# Altium schematic sheet Connectors.SchDoc: RP2040 Pico and HC-06 connections
size A4; Organization: Ernst-Abbe-Hochschule Jena; Address1: FB Maschinenbau; Address2: Carl-Zeiss-Promenade 2; Address3: 07745 Jena; Address4: Germany; DocumentNumber: 3; SheetNumber: 3; SheetTotal: 3
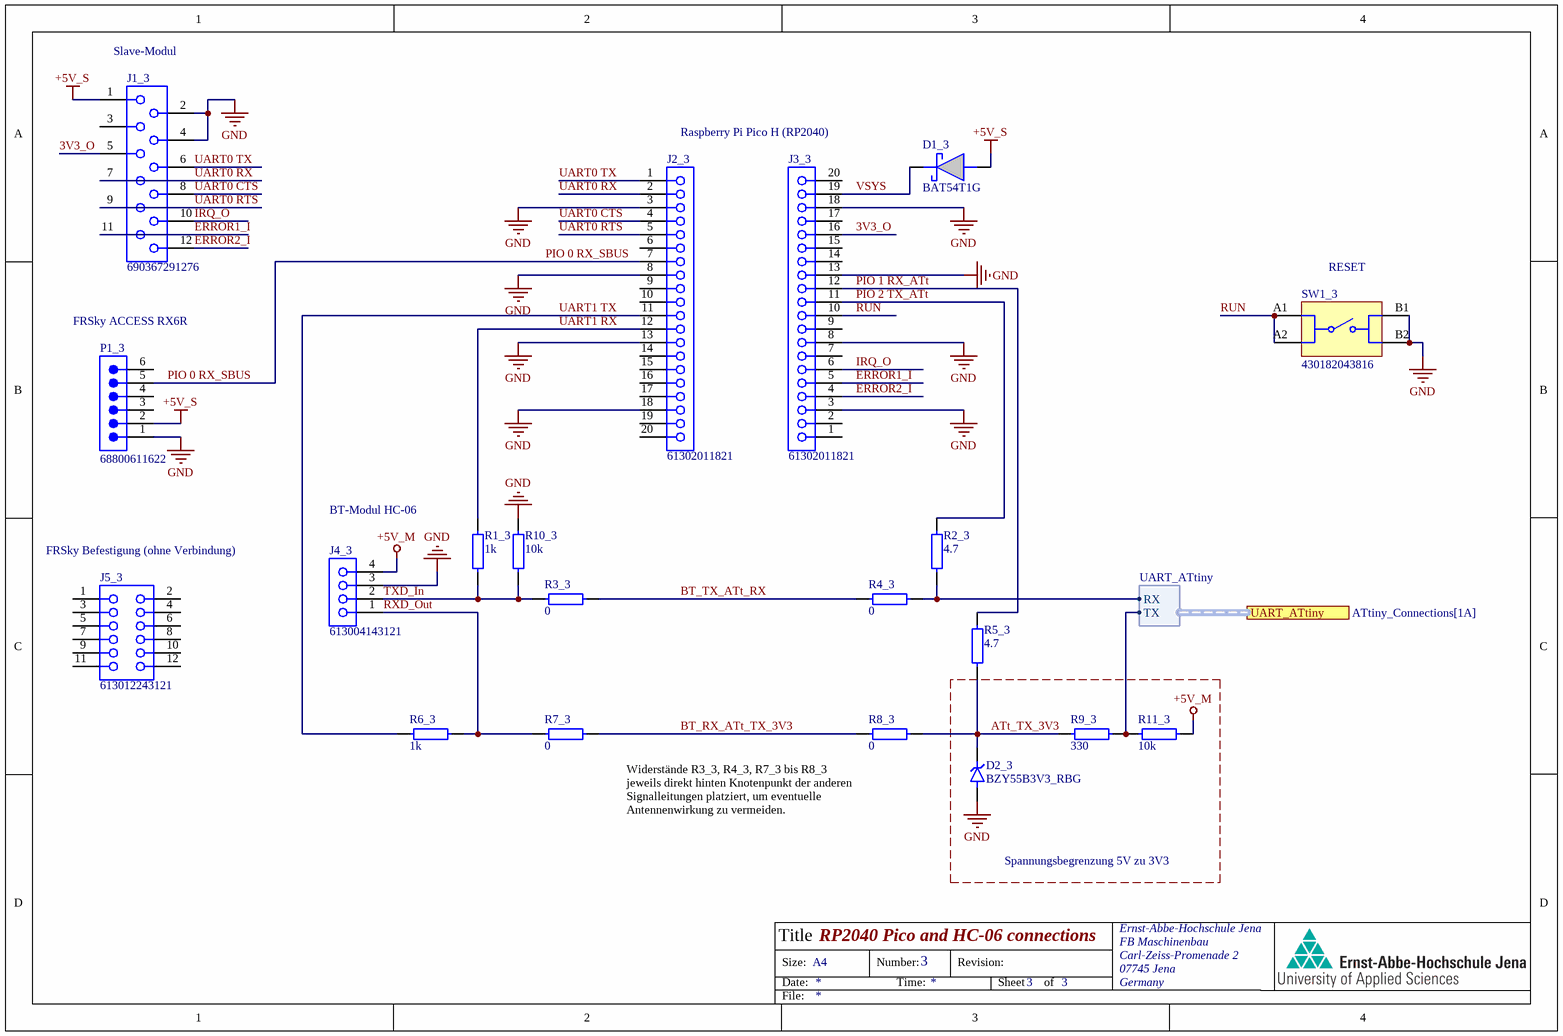
[diagram p0: Connectors.SchDoc]

## Parts
D1_3  BAT54T1G  [SOD3716X135N]
D2_3  BZY55B3V3_RBG  [DIO_BZY55B3V3_RBG]
J1_3  690367291276  [690367291276]
J2_3  61302011821  [61302011821]
J3_3  61302011821  [61302011821]
J4_3  613004143121  [613004143121]
J5_3  613012243121  [613012243121]
P1_3  68800611622  [68800611622]
R1_3  1k  [R-SMD-0805]
R2_3  4.7  [R-SMD-0805]
R3_3  0  [R-SMD-0805]
R4_3  0  [R-SMD-0805]
R5_3  4.7  [R-SMD-0805]
R6_3  1k  [R-SMD-0805]
R7_3  0  [R-SMD-0805]
R8_3  0  [R-SMD-0805]
R9_3  330  [R-SMD-0805]
R10_3  10k  [R-SMD-0805]
R11_3  10k  [R-SMD-0805]
SW1_3  430182043816  [430182043816]

## Blocks framed on the sheet
Spannungsbegrenzung 5V zu 3V3: D2_3 R9_3 R11_3

## Ports
UART_ATtiny (harness UART_ATtiny, see ATtiny_Connections[1A])

## Harnesses
UART_ATtiny: RX, TX

## Nets
+5V_M: J4_3.4 R11_3.1
+5V_S: D1_3.2(A) J1_3.1 P1_3.2
GND: D2_3.A J1_3.2 J1_3.4 J2_3.3 J2_3.8 J2_3.13 J2_3.18 J3_3.3 J3_3.8 J3_3.13 J3_3.18 J4_3.3 P1_3.1 R10_3.2 SW1_3.B1 SW1_3.B2
3V3_O: J1_3.5 J3_3.16
ATt_TX_3V3: D2_3.C(K) R5_3.1 R8_3.2 R9_3.2
BT_RX_ATt_TX_3V3: R7_3.2 R8_3.1
BT_TX_ATt_RX: R3_3.2 R4_3.1
ERROR1_I: J1_3.11 J3_3.5
ERROR2_I: J1_3.12 J3_3.4
IRQ_O: J1_3.10 J3_3.6
PIO 0 RX_SBUS: J2_3.7 P1_3.5
PIO 1 RX_ATt: J3_3.12 R5_3.2
PIO 2 TX_ATt: J3_3.11 R2_3.2
RUN: J3_3.10 SW1_3.A1 SW1_3.A2
RXD_Out: J4_3.1 R6_3.2 R7_3.1
TXD_In: J4_3.2 R1_3.1 R3_3.1 R10_3.1
UART0 CTS: J1_3.8 J2_3.4
UART0 RTS: J1_3.9 J2_3.5
UART0 RX: J1_3.7 J2_3.2
UART0 TX: J1_3.6 J2_3.1
UART1 RX: J2_3.12 R1_3.2
UART1 TX: J2_3.11 R6_3.1
VSYS: D1_3.1(K) J3_3.19
NetR2_3_1: R2_3.1 R4_3.2 ; port UART_ATtiny.RX
NetR9_3_1: R9_3.1 R11_3.2 ; port UART_ATtiny.TX

Not connected (* = marked no-connect by the designer): J1_3 3; J2_3 6 9 10 14 15 16 17 19 20; J3_3 1 2 7 9 14 15 17 20; J5_3 1 2 3 4 5 6 7 8 9 10 11 12; P1_3 3 4 6

## Notes on the sheet
- (near J1_3) Slave-Modul
- Raspberry Pi Pico H (RP2040)
- (near SW1_3) RESET
- (near P1_3) FRSky ACCESS RX6R
- BT-Modul HC-06
- (near J5_3) FRSky Befestigung (ohne Verbindung)
- Widerstände R3_3, R4_3, R7_3 bis R8_3 jeweils direkt hinten Knotenpunkt der anderen Signalleitungen platziert, um eventuelle Antennenwirkung zu vermeiden.
- Title
- Size:
- Date:
- A4
- Number:
- Time:
- Revision:
- Sheet
- of
- File:

## Library data of the parts
D1_3 = BAT54T1G: S Prefix for Automotive and Other Applications Requiring Unique Site and Control Change Requirements; AEC-Q101 Qualified and PPAP Capable; Low Forward Voltage 350 mV (Typ) @ IF = 10 mA; Extremely Fast Switching Speed; These Devices are Pb-Free, Halogen Free/BFR Free and are RoHS Compliant; Manufacturer_Name: onsemi; Geometry.Height: 1.35mm; Manufacturer_Part_Number: BAT54T1G; Mouser Part Number: 863-BAT54T1G; Mouser Price/Stock: https://www.mouser.co.uk/ProductDetail/onsemi/BAT54T1G?qs=vLkC5FC1VN9XK%252B%252BtdP3lYw%3D%3D; Arrow Part Number: BAT54T1G; Arrow Price/Stock: https://www.arrow.com/en/products/bat54t1g/on-semiconductor?utm_currency=USD&region=nac; Datasheet Link: https://www.onsemi.com/pub/Collateral/BAT54T1-D.PDF
J1_3 = 690367291276: WR-MM Mini Module Connector, Female, SMT, with Latch & Polarization, Straight, pitch 2.54mm, 12p; Manufacturer: Wurth Elektronik; Contact Resistance: 10mΩ; Insulation Resistance: 1000MΩ; Rated Current: 1.5A; Working Voltage: 250VAC; Withstanding Voltage: 500VAC; ComponentLink1Description: Website Link; ComponentLink1URL: https://www.we-online.com/redexpert/article/690367291276?ad; ComponentLink2Description: Datasheet Link; ComponentLink2URL: https://www.we-online.com/redexpert/spec/690367291276?ad; Manufacturer Part Number: 690367291276; Category: Board-to-Board Connectors; Match Code: WR-MM; Mount: Surface Mount; Operating Temperature Max: 105°C; Operating Temperature Min: -40°C; Packaging: Tape and Reel; Length: 19.84mm; Gender: Female; Number of Pins: 12; Orientation: Straight; Pitch: 2.54mm
J2_3 J3_3 = 61302011821: WR-PHD Socket Header, THT, Vertical, pitch 2.54mm, 1 Row, 20P; Manufacturer: Wurth Elektronik; Contact Resistance: 20mOhm; Rated Current: 3A; Working Voltage: 250V; Withstanding Voltage: 500V; Manufacturer Part Number: 61302011821; Category: Board-to-Board Connectors; Match Code: WR-PHD; ComponentLink1Description: Website Link; ComponentLink1URL: https://www.we-online.com/redexpert/article/61302011821?ad; ComponentLink2Description: Datasheet Link; ComponentLink2URL: https://www.we-online.com/redexpert/spec/61302011821?ad; Mount: Through Hole; Operating Temperature Max: 105°C; Operating Temperature Min: -40°C; Packaging: Tray; Gender: Socket Header; Number of Pins: 20; Number of Rows: 1; Orientation: Vertical; Pitch: 2.54mm
  J3_3: ClassName: RPI_Pico
J4_3 = 613004143121: WR-PHD Socket Header, THT, Angled, pitch 2.54mm, 1 Row, 4P; Manufacturer: Wurth Elektronik; Contact Resistance: 20mOhm; Rated Current: 3A; Working Voltage: 250V; Withstanding Voltage: 500V; Manufacturer Part Number: 613004143121; Category: Board-to-Board Connectors; Match Code: WR-PHD; ComponentLink1Description: Website Link; ComponentLink1URL: https://www.we-online.com/redexpert/article/613004143121?ad; ComponentLink2Description: Datasheet Link; ComponentLink2URL: https://www.we-online.com/redexpert/spec/613004143121?ad; Mount: Through Hole; Operating Temperature Max: 125°C; Operating Temperature Min: -40°C; Packaging: Tray; Gender: Socket Header; Number of Pins: 4; Number of Rows: 1; Orientation: Angled; Pitch: 2.54mm
J5_3 = 613012243121: WR-PHD Socket Header, THT, Angled, pitch 2.54mm, 2 Row, 12P; Manufacturer: Wurth Elektronik; Contact Resistance: 20mOhm; Rated Current: 3A; Working Voltage: 250V; Withstanding Voltage: 500V; Manufacturer Part Number: 613012243121; Category: Board-to-Board Connectors; Match Code: WR-PHD; ComponentLink1Description: Website Link; ComponentLink1URL: https://www.we-online.com/redexpert/article/613012243121?ad; ComponentLink2Description: Datasheet Link; ComponentLink2URL: https://www.we-online.com/redexpert/spec/613012243121?ad; Mount: Through Hole; Operating Temperature Max: 125°C; Operating Temperature Min: -40°C; Packaging: Tray; Gender: Socket Header; Number of Pins: 12; Number of Rows: 2; Orientation: Angled; Pitch: 2.54mm
P1_3 = 68800611622: WR-WTB “J” Type THT Vertical Male Shrouded Header, pitch 2.5 mm, 6 pins; Manufacturer: Wurth Elektronik; Pitch: 2.5 mm; Rated Current: 3 A; Working Voltage: 250 V(AC); Contact Resistance: 20 mΩ; Withstanding Voltage: 800 V(AC); Manufacturer Part Number: 68800611622; Category: Wire-to-Board Connector; Match Code: WR-WTB; ComponentLink1Description: Website Link; ComponentLink1URL: https://www.we-online.com/redexpert/article/68800611622?ad; ComponentLink2Description: Datasheet Link; ComponentLink2URL: https://www.we-online.com/redexpert/spec/68800611622?ad; Mount: Through Hole; Min Operating Temperature: -25 °C; Max Operating Temperature: 85 °C; Packaging: Bag; Number of Pins: 6; Number of Rows: 1; Orientation: Vertical; Length: 17.5 mm; Width: 3.8 mm; Height: 6 mm; Gender: Male
R1_3 R2_3 R3_3 R4_3 R5_3 R6_3 R7_3 R8_3 R9_3 R10_3 R11_3 = R: Widerstand
  R1_3 R6_3: Value: 1k
  R2_3 R5_3: Value: 4.7
  R3_3 R4_3 R7_3 R8_3: Value: 0
  R9_3: Value: 330
  R10_3 R11_3: Value: 10k
SW1_3 = 430182043816: WS-TASV SMT Tact Switch, 6mm x 6mm, 160gf, SPST-NO, 12V, 50mA; Manufacturer: Wurth Elektronik; Washable: No; Manufacturer Part Number: 430182043816; Category: Tact Switch; Match Code: WS-TASV; ComponentLink1Description: Website Link; ComponentLink1URL: https://www.we-online.com/redexpert/article/430182043816?ad; ComponentLink2Description: Datasheet Link; ComponentLink2URL: https://www.we-online.com/redexpert/spec/430182043816?ad; Mount: Surface Mount; Min Operating Temperature: -40°C; Max Operating Temperature: 85°C; Packaging: Tape and Reel; Length: 6mm; Width: 6mm; Height: 4.3mm; Circuit: SPST-NO; Contact Material: Stainless Steel; Contact Plating: Silver; Operation Force: 160gf; Rated Current: 50mA; Rated Voltage (DC): 12V; Terminal Material: Copper Alloy; Terminal Plating: Silver
D2_3 = BZY55B3V3_RBG: Price: None; Package: None; Availability: Unavailable; Value: *; MP: BZY55B3V3_RBG